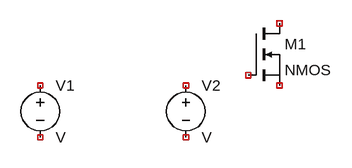
[diagram p0: schematic Mosfet.asc]
Mosfet.asc, the LTspice schematic file:
Version 4.1
SHEET 1 880 680
SYMBOL nmos 208 112 R0
SYMATTR InstName M1
SYMBOL voltage -112 192 R0
SYMATTR InstName V1
SYMBOL voltage 112 192 R0
SYMATTR InstName V2

The netlist it stands for:
* Mosfet.asc
M1 NC_01 NC_02 NC_03 NC_03 NMOS
V1 NC_04 NC_05 V
V2 NC_06 NC_07 V
.model NMOS NMOS
.model PMOS PMOS
.lib standard.mos
.backanno
.end